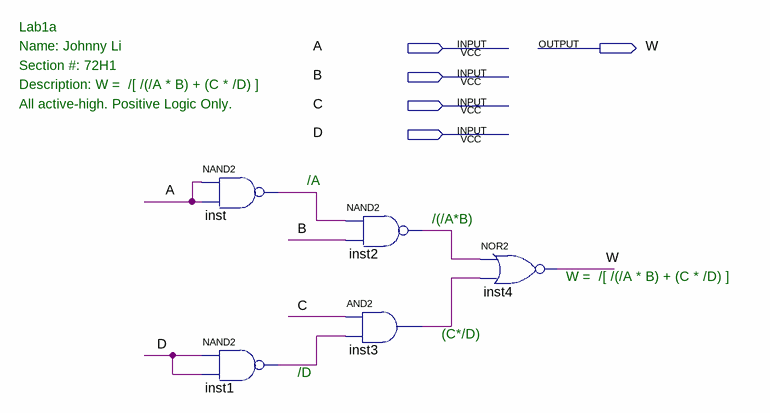
[diagram p0: schematic sheet]
// Quartus schematic lab1a.bdf as structural Verilog: 5 symbols, 5 pins
module lab1a (
  input  A,
  input  B,
  input  C,
  input  D,
  output W
);

  wire inst1_out, inst2_out, inst3_out, inst_out;

  nand inst (inst_out, A, A);
  nand inst1 (inst1_out, D, D);
  nand inst2 (inst2_out, inst_out, B);
  and inst3 (inst3_out, C, inst1_out);
  nor inst4 (W, inst2_out, inst3_out);

  // Notes on the sheet:
  //   Lab1a
  //   Name: Johnny Li
  //   Section #: 72H1
  //   Description: W =  /[ /(/A * B) + (C * /D) ]
  //   All active-high. Positive Logic Only.
  //   /A
  //   /(/A*B)
  //   W =  /[ /(/A * B) + (C * /D) ]
  //   (C*/D)
  //   /D
endmodule
